# EAGLE design smoke_tester.v1 (EAGLE 5.07)
LEFT: NORMAL; LICENSE: license; PROJECT: smoke tester v1; RIGHT: BYPASS
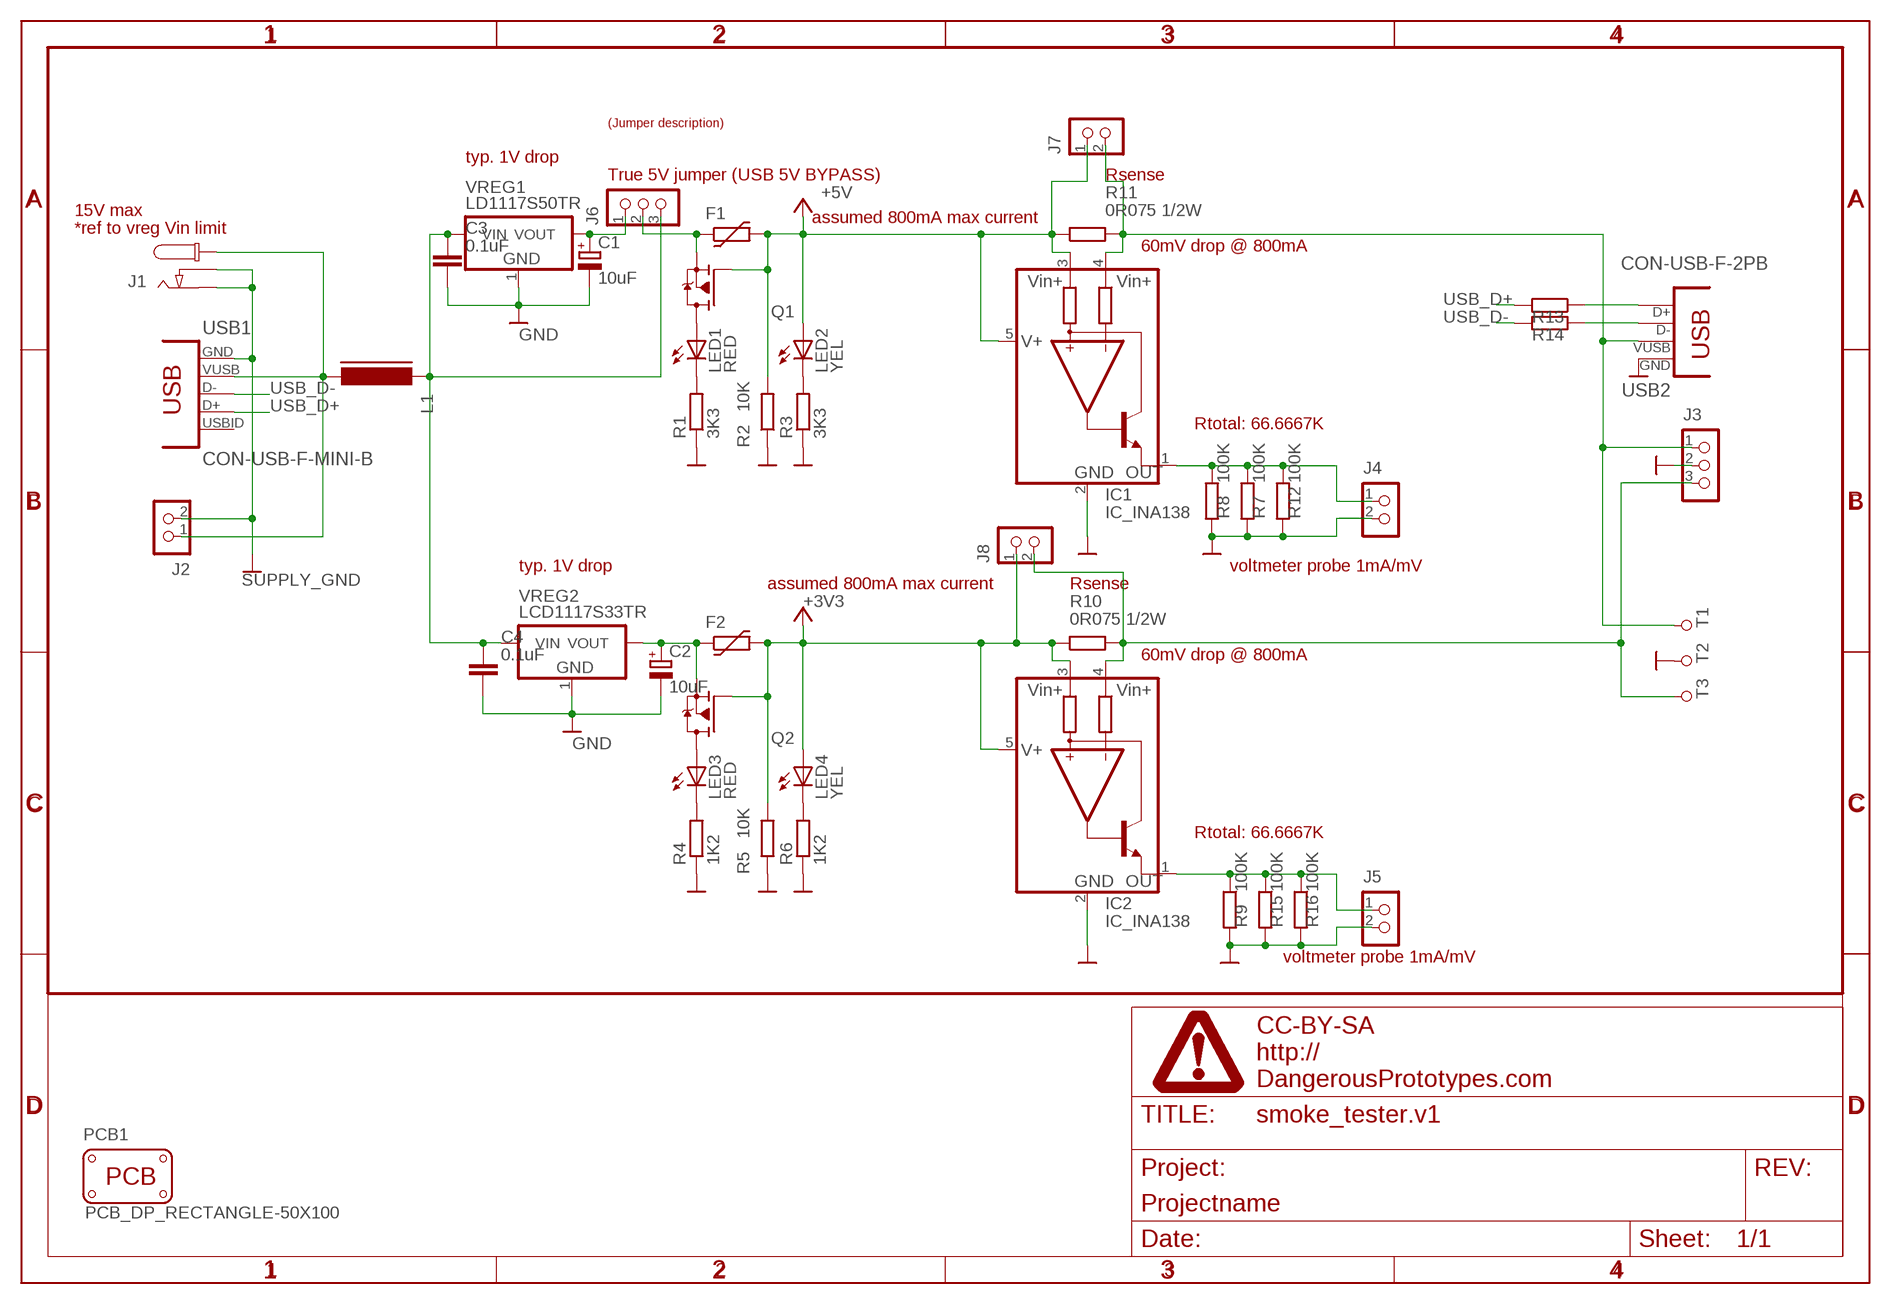
[diagram p0: schematic, sheet 1]

## Parts
C1  10uF  CAPACITOR_POL-SMC_A  [SMC_A]
C2  10uF  CAPACITOR_POL-SMC_A  [SMC_A]
C3  0.1uF  CAPACITOR_NPOL-0603  [C603]
C4  0.1uF  CAPACITOR_NPOL-0603  [C603]
F1  FUSE_PTC-1812  [PTC1812L]
F2  FUSE_PTC-1812  [PTC1812L]
IC1  IC_INA138  [SOT-23-5]
IC2  IC_INA138  [SOT-23-5]
J1  CON_DC_M-DC_SMD  [DC_BARREL_JACK_SMD_2MM]
J2  CON_TERMINAL_BLOCK_02-5MM  [TERMINAL_BLOCK_2P_5]
J3  CON_TERMINAL_BLOCK_03-5MM  [TERMINAL_BLOCK_3P_5]
J4  CON_HEADER_1X02-PTH  [M1X2]
J5  CON_HEADER_1X02-PTH  [M1X2]
J6  CON_HEADER_1X03-PTH  [M1X3]
J7  CON_HEADER_1X02-PTH  [M1X2]
J8  CON_HEADER_1X02-PTH  [M1X2]
L1  FERRITE-0603  [FB603]
LED1  RED  LED-0805  [LED-805]
LED2  YEL  LED-0805  [LED-805]
LED3  RED  LED-0805  [LED-805]
LED4  YEL  LED-0805  [LED-805]
PCB1  PCB_DP_RECTANGLE-50X100  [DP10050_V1]
Q1  TRANSISTOR_FET_TSM2301CX  [SOT-23]
Q2  TRANSISTOR_FET_TSM2301CX  [SOT-23]
R1  3K3  RESISTOR-0603  [R603]
R2  10K  RESISTOR-0603  [R603]
R3  3K3  RESISTOR-0603  [R603]
R4  1K2  RESISTOR-0603  [R603]
R5  10K  RESISTOR-0603  [R603]
R6  1K2  RESISTOR-0603  [R603]
R7  100K  RESISTOR-0603  [R603]
R8  100K  RESISTOR-0603  [R603]
R9  100K  RESISTOR-0603  [R603]
R10  0R075 1/2W  RESISTOR-1206  [R1206]
R11  0R075 1/2W  RESISTOR-1206  [R1206]
R12  100K  RESISTOR-0603  [R603]
R13  RESISTOR-0603  [R603]
R14  RESISTOR-0603  [R603]
R15  100K  RESISTOR-0603  [R603]
R16  100K  RESISTOR-0603  [R603]
T1  PAD_TERMINAL-4.1MMROUND  [PAD_ROUND_4.1MM]
T2  PAD_TERMINAL-4.1MMROUND  [PAD_ROUND_4.1MM]
T3  PAD_TERMINAL-4.1MMROUND  [PAD_ROUND_4.1MM]
U$1  FRAME_DINA4_L  [DP_LOGO]
U$5  LABEL_JUMPER_1X3  [JUMP3_DESC]
USB1  CON-USB-F-MINI-B  [CONN_USB_MINI-B]
USB2  CON-USB-F-2PB  [CONN_USB_A_F]
VREG1  LD1117S50TR  VREG_3PINS-SOT-223  [SOT-223]
VREG2  LCD1117S33TR  VREG_3PINS-SOT-223  [SOT-223]

## Nets
+3V3: F2.2 IC2.3(VIN+) IC2.5(V+) J8.1 LED4.A Q2.1(G) R5.2 R10.1 ; supply symbol labelled SUPPLY_+3V3
+3V3O: IC2.4(VIN-) J3.3 J8.2 R10.2 T3.P
+5V: F1.2 IC1.3(VIN+) IC1.5(V+) J7.1 LED2.A Q1.1(G) R2.2 R11.1 ; supply symbol labelled SUPPLY_+5V
+5VO: IC1.4(VIN-) J3.1 J7.2 R11.2 T1.P USB2.1(VUSB)
GND: C1.- C2.- C3.2 C4.2 IC1.2(GND) IC2.2(GND) J1.P2 J1.P3 J2.2 J3.2 J4.2 J5.2 R1.1 R2.1 R3.1 R4.1 R5.1 R6.1 R7.2 R8.2 R9.2 R12.2 R15.2 R16.2 T2.P USB1.GND USB2.4(GND) VREG1.1(GND) VREG2.1(GND) ; supply symbol labelled SUPPLY_GND
N$1: J1.P1@2(P1) J2.1 L1.2 USB1.VUSB
N$2: C3.1 C4.1 J6.3 L1.1 VREG1.3(VIN) VREG2.3(VIN)
N$3: C2.+ F2.1 Q2.2(S) VREG2.2(VOUT)
N$4: LED1.A Q1.3(D)
N$5: LED1.C R1.2
N$6: IC1.1(OUT) J4.1 R7.1 R8.1 R12.1
N$7: F1.1 J6.2 Q1.2(S)
N$8: LED2.C R3.2
N$9: LED3.A Q2.3(D)
N$10: LED3.C R4.2
N$11: LED4.C R6.2
N$12: R13.1 USB2.3(D+)
N$13: IC2.1(OUT) J5.1 R9.1 R15.1 R16.1
N$14: R14.1 USB2.2(D-)
N$15: C1.+ J6.1 VREG1.2(VOUT)
USB_D+: R13.2 USB1.D+
USB_D-: R14.2 USB1.D-
Unconnected: USB1.BODY@1(BODY) USB1.BODY@2(BODY) USB1.BODY@3(BODY) USB1.BODY@4(BODY) USB1.ID(USBID) USB2.B1(BODY) USB2.B2(BODY)

## Notes on the sheet
- typ. 1V drop
- True 5V jumper (USB 5V BYPASS) | Rsense
- 15V max
- assumed 800mA max current
- *ref to vreg Vin limit
- 60mV drop @ 800mA
- Rtotal: 66.6667K
- typ. 1V drop | voltmeter probe 1mA/mV
- assumed 800mA max current | Rsense
- 60mV drop @ 800mA
- Rtotal: 66.6667K
- voltmeter probe 1mA/mV

## Library data of the parts
C1 C2 = dp_devices:CAPACITOR_POL: Polarized capacitor in various packages
C3 C4 = dp_devices:CAPACITOR_NPOL: Non-Polarized capacitor in various packages
F1 F2 = dp_devices:FUSE_PTC: Resettable PTC
IC1 IC2 = dp_devices:IC_INA138: High Side Current Shunt Monitor Mfr no: INA138NA/3K INA138 <http://www.ti.com/lit/ds/symlink/ina138.pdf>
J1 = dp_devices:CON_DC_M: DC power connector
J2 = dp_devices:CON_TERMINAL_BLOCK_02: 2 poles wire to board terminal block
J3 = dp_devices:CON_TERMINAL_BLOCK_03: 3 poles, wire to board connector
J4 J5 J7 J8 = dp_devices:CON_HEADER_1X02
J6 = dp_devices:CON_HEADER_1X03
L1 = dp_devices:FERRITE: Ferrite bead in various packages
LED1-LED4 = dp_devices:LED: Light Emitting Diode
PCB1 = dp_devices:PCB_DP_RECTANGLE: Dangerous Prototypes Standard Rectangular PCB sizes
Q1 Q2 = dp_devices:TRANSISTOR_FET_TSM2301CX: 20V P-Channel Enhancement Mode MOSFET
R1-R16 = dp_devices:RESISTOR
T1-T3 = dp_devices:PAD_TERMINAL: Terminal connection pad
U$1 = dp_devices:FRAME_DINA4_L: A4 DP frame Standard Dangerous Prototypes schematic frame. Automagically adds the DP logo and standard texts to the PCB Use the atrribute in the schematic editor to change the fields.; FF1: fulfillment by; FF2: Seeed Studio; FF3: www.seeedstudio.com; LICENSE: CC-BY-SA; PROJECT: Projectname; URL1: http://; URL2: DangerousPrototypes.com
U$5 = dp_devices:LABEL_JUMPER_1X3: Nice formatted three legged jumperdescription Use attributes to change the values LEFT = With jumper to the left RIGHT = With jumper to the right; LEFT: left; RIGHT: right
USB1 = dp_devices:CON-USB-F: USB Female connector
USB2 = dp_devices:CON-USB-F-2PB: USB Female connector with 2 body pins
VREG1 VREG2 = dp_devices:VREG_3PINS: Various 3 pin voltage regulators in different packages Double check the right pinout for the right part

## Board
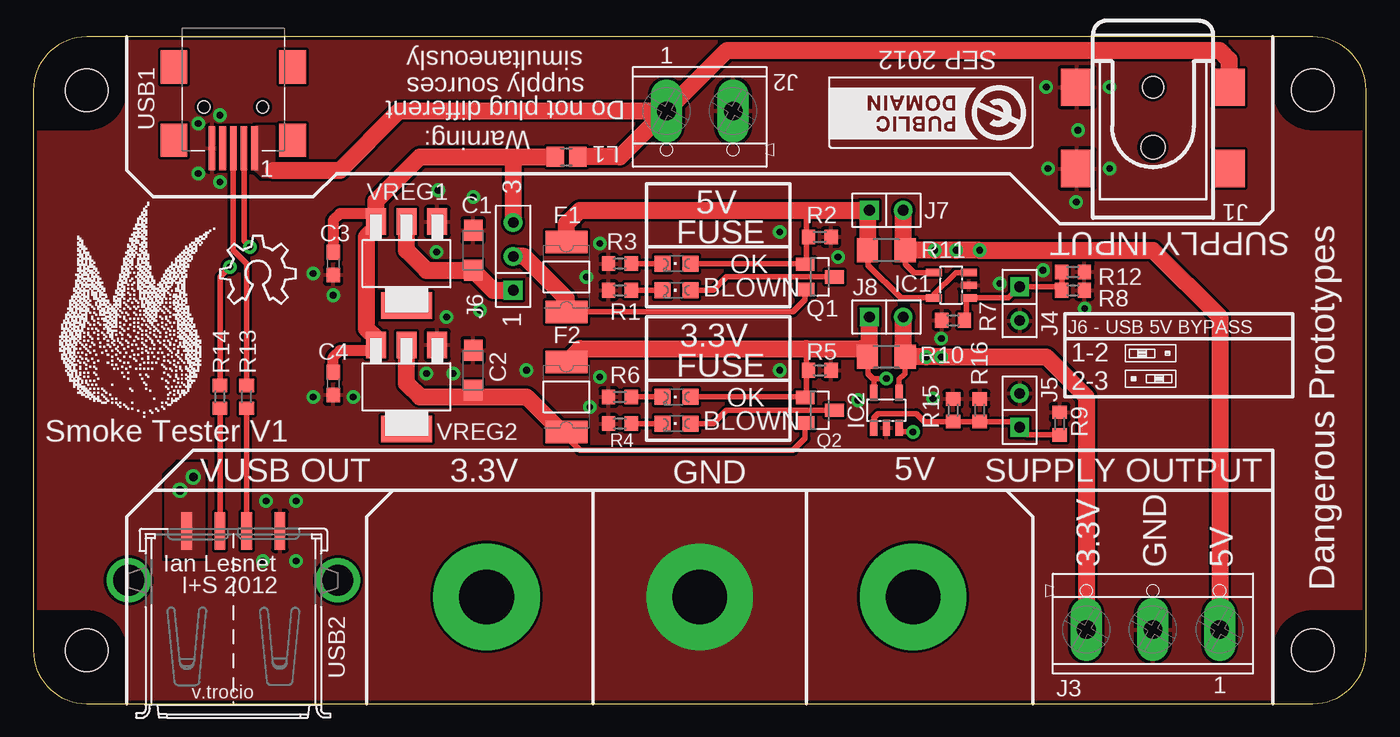
[diagram p1: board, top side]
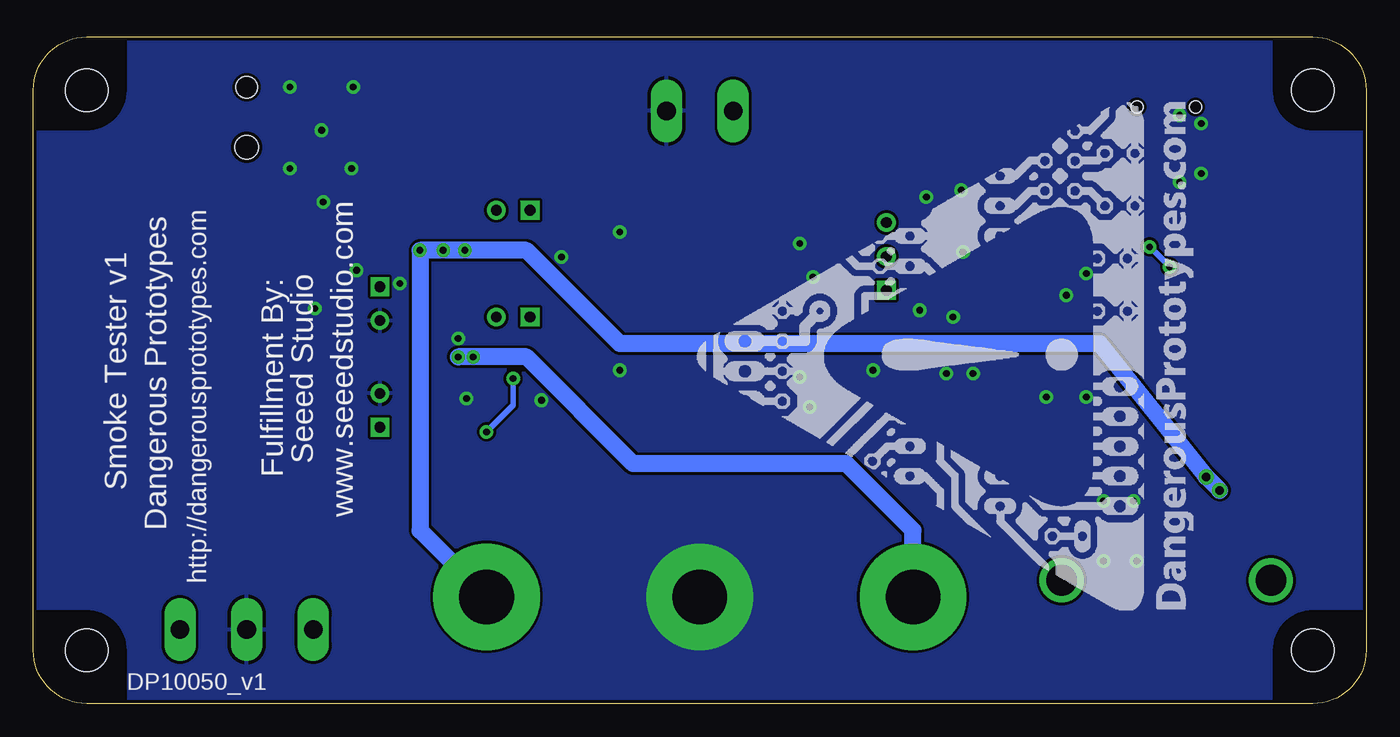
[diagram p2: board, bottom side, seen from below]

Size 100 x 50 mm. Coordinates in mm from the lower left corner, seen from the top.
Copper layers (1*16): Top 0.035mm / dielectric 1.5mm / Bottom 0.035mm
Design rules "SparkFun": minimum track width 8mil, minimum drill 20mil, track to track 8mil, track to pad 8mil, pad to pad 8mil, via to via 8mil, smd to smd 8mil, copper to edge 10mil, drill to drill 8mil, minimum pad ring 12mil, minimum via ring 10mil, stop-mask expansion 4mil, vias tented up to drill 25mil, thermal gap 10mil

### Footprints (pad centres in the part's own frame; a part is rotated, then mirrored left to right if it is on the bottom)
SMC_A = smd 1.6 x 1.4: + -1.5,0; - 1.5,0
C603 = smd 1.1 x 1: 1 -0.85,0; 2 0.85,0
PTC1812L = smd 1.7 x 3.15: 1 -2.62,0; 2 2.62,0
SOT-23-5 = smd 0.55 x 1.2: 1 -0.95,-1.3; 2 0,-1.3; 3 0.95,-1.3; 4 0.95,1.3; 5 -0.95,1.3
DC_BARREL_JACK_SMD_2MM = smd 2.4 x 2.8: P1@1 -5.7,3.875; P1@2 -5.7,-2.225; P2 5.7,-2.225; P3 5.7,3.875 | hole 1.8: 0,2.275 | hole 1.6: 0,-2.225
TERMINAL_BLOCK_2P_5 = drill 1.4 pad 2.38 long: 1 2.5,-0.45; 2 -2.5,-0.45
TERMINAL_BLOCK_3P_5 = drill 1.4 pad 2.38 long: 1 5,-0.45; 2 0,-0.45; 3 -5,-0.45
M1X2 = drill 0.8 square: 1 -1.27,0 | drill 0.8 round: 2 1.27,0
M1X3 = drill 0.8 square: 1 0,0 | drill 0.8 round: 2 2.54,0; 3 5.08,0
FB603 = smd 1.3 x 1.5: 1 -0.85,0; 2 0.85,0
LED-805 = smd 1.2 x 1.2: A 0,-1.05; C 0,1.05
DP10050_V1 = hole 3.2: 4,4; 96,4; 96,46; 4,46
SOT-23 = smd 1 x 1.4: 1 -0.95,-1.1; 2 0.95,-1.1; 3 0,1.1
R603 = smd 1 x 1.1: 1 -0.85,0; 2 0.85,0
R1206 = smd 1.6 x 1.803: 1 -1.422,0; 2 1.422,0
PAD_ROUND_4.1MM = drill 4.1 pad 8 round: P 0,0
CONN_USB_MINI-B = smd 2 x 2.5: BODY@1 -4.45,2.5; BODY@2 4.45,2.5; BODY@3 4.45,-3; BODY@4 -4.45,-3 | smd 0.5 x 3.3: D+ 0,3.1; D- -0.8,3.1; GND 1.6,3.1; ID 0.8,3.1; VUSB -1.6,3.1 | hole 0.9: -2.2,0; 2.2,0
CONN_USB_A_F = smd 0.8 x 2.82: 1 -3.5,6.46; 2 -1,6.46; 3 1,6.46; 4 3.5,6.46 | drill 2.3 round: B1 -7.85,2.75; B2 7.85,2.75
SOT-223 = smd 1.5 x 2: 1 -2.3,-3.15; 2 0,-3.15; 3 2.3,-3.15 | smd 3.8 x 2: 4 0,3.15

### Placement (x,y rotation side)
C1  33,34 90 top
C2  33,25 90 top
C3  22.5,33 270 top
C4  22.5,24 270 top
E$1  [LOGO_FLAME]  2,21.5 0 top
E$2  [DP_LOGO_ART_1.5X1.5]  13,7 90 bottom
F1  40,32 90 top
F2  40,23 90 top
IC1  68.88,31.38 90 top
IC2  64,22 0 top
J1  84,44 180 top
J2  50,44 180 top
J3  84,6 0 top
J4  74,30 270 top
J5  74,22 90 top
J6  36,31 90 top
J7  64,37 0 top
J8  64,29 0 top
L1  40,41 0 top
LED1  48.25,31 90 top
LED2  48.25,33 90 top
LED3  48.25,21 90 top
LED4  48.25,23 90 top
PCB1  0,0 0 top
Q1  59,32 270 top
Q2  59,22 270 top
R1  44,31 0 top
R2  59,35 180 top
R3  44,33 0 top
R4  44,21 0 top
R5  59,25 180 top
R6  44,23 0 top
R7  69,28.75 180 top
R8  78,31 0 top
R9  77,21 90 top
R10  64,26 0 top
R11  64,34 0 top
R12  78,32.38 0 top
R13  16,23 90 top
R14  14,23 90 top
R15  69,22 90 top
R16  71,22 90 top
T1  66,8 0 top
T2  50,8 0 top
T3  34,8 0 top
U$1  0.93,-8.63 0 top  (outside the outline)
U$2  [LOGO_CC-0]  75,47 180 top
U$3  [OSHW_8X200_NOTEXT]  14,30 0 top
U$5  87,25 0 top
USB1  15,44.75 180 top
USB2  15,6.5 0 top
VREG1  28,33 180 top
VREG2  28,23.75 180 top

### Tracks (layer width: path | path; a pad name or v marks a point on that pad's centre or on a via)
+3V3  (via drill 0.51)
  Top 0.406: 58,23 LED4.A | 58,23 58,24.85 R5.2 58,25 58,26.62 | 63,24.38 62.62,24.75 62.62,25.95 R10.1 | IC2.5 63.05,24.32 63,24.38 | 63,24.38 v64,24.38 | IC2.3 64.95,20.43 65,20.38 v66,20.38 | Q2.1 57.95,22.95 58,23
  Top 1.27: F2.2 41,26.62 58,26.62 62.11,26.62 62.73,26 R10.1 62.73,26.15 J8.1
  Bottom 0.406: v64,24.38 64,22.38 v66,20.38
+3V3O  (via drill 0.51)
  Top 0.406: IC2.4 64.95,24.32 65.38,24.75 65.38,25.95 R10.2
  Top 1.27: J3.3 79,23 76,26 v68.12,26 v67,26 R10.2 65.27,26.15 J8.2
  Bottom 1.27: T3.P 34,13 39,18 55,18 63,26 v68.12,26
+5V
  Top 0.406: 58,37 58,35 R2.2 58,34.85 58,33 | 58,33 LED2.A | R11.1 62.62,33.95 62.62,32.88 65.08,30.43 IC1.5 67.58,30.7 69.2,32.33 IC1.3 | Q1.1 58,32.95 58,33
  Top 1.27: F1.2 40,36 41,37 58,37 J7.1 62.58,36.85 R11.1
+5VO  (via drill 0.51, 0.64)
  Top 0.406: IC1.4 66.05,32.33 65.42,32.95 R11.2
  Top 1.27: J3.1 89,29 84,34 v71,34 v69.25,34 v67.62,34 R11.2 65.27,34.15 J7.2
  Bottom 1.27: T1.P 71,13 v71,34 63,34 56,27 20,27 v12,17 v11,16
  pour Top (no thermals): 11,18 12.75,18 12.75,11 10,11 10,17
GND  (via drill 0.51)
  other vias: 17.46,15.19 19.71,15.19 17.21,10.69 19.71,10.69 29.5,24.75 31,29 21,32.25 21,23 33.5,29.5 37,25 33,38 30.25,33.88 30.38,38.5 31.5,24.75 22.5,30.62 24,23 42.5,34.5 41.5,32 41.75,22.25 42.5,24.5 61.88,22.75 60.38,33.5 14,44.12 12.38,39.75 14,39.12 12.38,43.5 76,46.25 78.38,43 80.75,46.25 76.12,40.12 78.25,37.62 80.75,40.12 56,25 56,35.38 68.12,27.38 67.5,22.88 78.88,29.62 72.5,31.5 75.75,32.5
  pour Top (rank 6): 0,50 100,50 100,0 0,0
  pour Bottom: 0,50 100,50 100,0 0,0
N$1
  Top 0.813: J2.1 47.45,44.45
  Top 1.27: 18,40 23,40 27.45,44.45 J2.1 52.05,49 89,49 89.7,48.3 J1.P1@2 | 47.45,44.45 44,41 L1.2
  pour Top (no thermals): 16.75,43.25 18,43.25 18,39.5 17.25,39.5 16.75,40
N$2
  Top 0.813: VREG2.3 25.7,26.57 25.62,26.5 23,26.5 22.5,26 C4.1 | C3.1 22.5,36.25 23,36.75 25.57,36.75 25.7,36.88
  Top 1.27: 36,41 L1.1 | 36,41 J6.3 | 36,41 29,41 25.7,37.7 25.7,36.88 VREG1.3 25.7,35.7 25,35 25,28.12 25.7,27.43 VREG2.3
N$3
  Top 0.406: F2.1 40,20 41,19 57,19 57.9,19.9 Q2.2
  Top 0.813: 39.62,20 F2.1 39.62,20.38
  Top 1.27: 33,23 29,23 28,24 VREG2.2 | 33,23 37,23 39.62,20.38 | 33,23 C2.+
N$4
  Top 0.406: Q1.3 52,32 51,31 LED1.A
N$5
  Top 0.406: R1.2 LED1.C
N$6
  Top 0.406: R7.1 69.85,28.85 70,29 70,30.25 IC1.1 73.16,30.43 J4.1 76.88,31.27 R8.1 R12.1
N$7
  Top 0.406: F1.1 57,29.38 57.9,30.28 Q1.2
  Top 1.27: J6.2 36.84,33.54 40,30.38 F1.1
N$8
  Top 0.406: R3.2 LED2.C
N$9
  Top 0.406: Q2.3 52,22 51,21 LED3.A
N$10
  Top 0.406: R4.2 LED3.C
N$11
  Top 0.406: R6.2 LED4.C
N$12
  Top 0.406: USB2.3 R13.1
N$13
  Top 0.406: IC2.1 63.05,21.43 63.38,21.75 66.25,21.75 66.85,21.15 R15.1 R16.1 73.58,21.15 J5.1 74.58,20.15 R9.1
N$14
  Top 0.406: USB2.2 R14.1
N$15
  Top 1.27: VREG1.2 28,34 29.5,32.5 C1.+ 34.5,31 J6.1
USB_D+
  Top 0.406: R13.2 16,33 15,34 USB1.D+
USB_D-  (via drill 0.51)
  Top 0.406: R14.2 14,32 v14.75,32.75 | USB1.D- 15.8,34.7 v16.25,34.25
  Bottom 0.406: v14.75,32.75 v16.25,34.25

### Text on the board
tPlace: simultaneously | SEP 2012 | supply sources | Do not plug different | Warning: | 3 | 5V | SUPPLY INPUT | FUSE | OK | BLOWN | 1 | J6 - USB 5V BYPASS | 3.3V | 1-2 | FUSE | 2-3 | OK | Smoke Tester V1 | BLOWN | VUSB OUT | 3.3V | 5V | SUPPLY OUTPUT | GND | Ian Lesnet | 3.3V | GND | 5V | I+S 2012 | Dangerous Prototypes | v.trocio
bPlace: Seeed Studio | Fulfillment By: | Smoke Tester v1 | www.seeedstudio.com | Dangerous Prototypes | http://dangerousprototypes.com